# EAGLE design schemat1 (EAGLE 8.3.0)
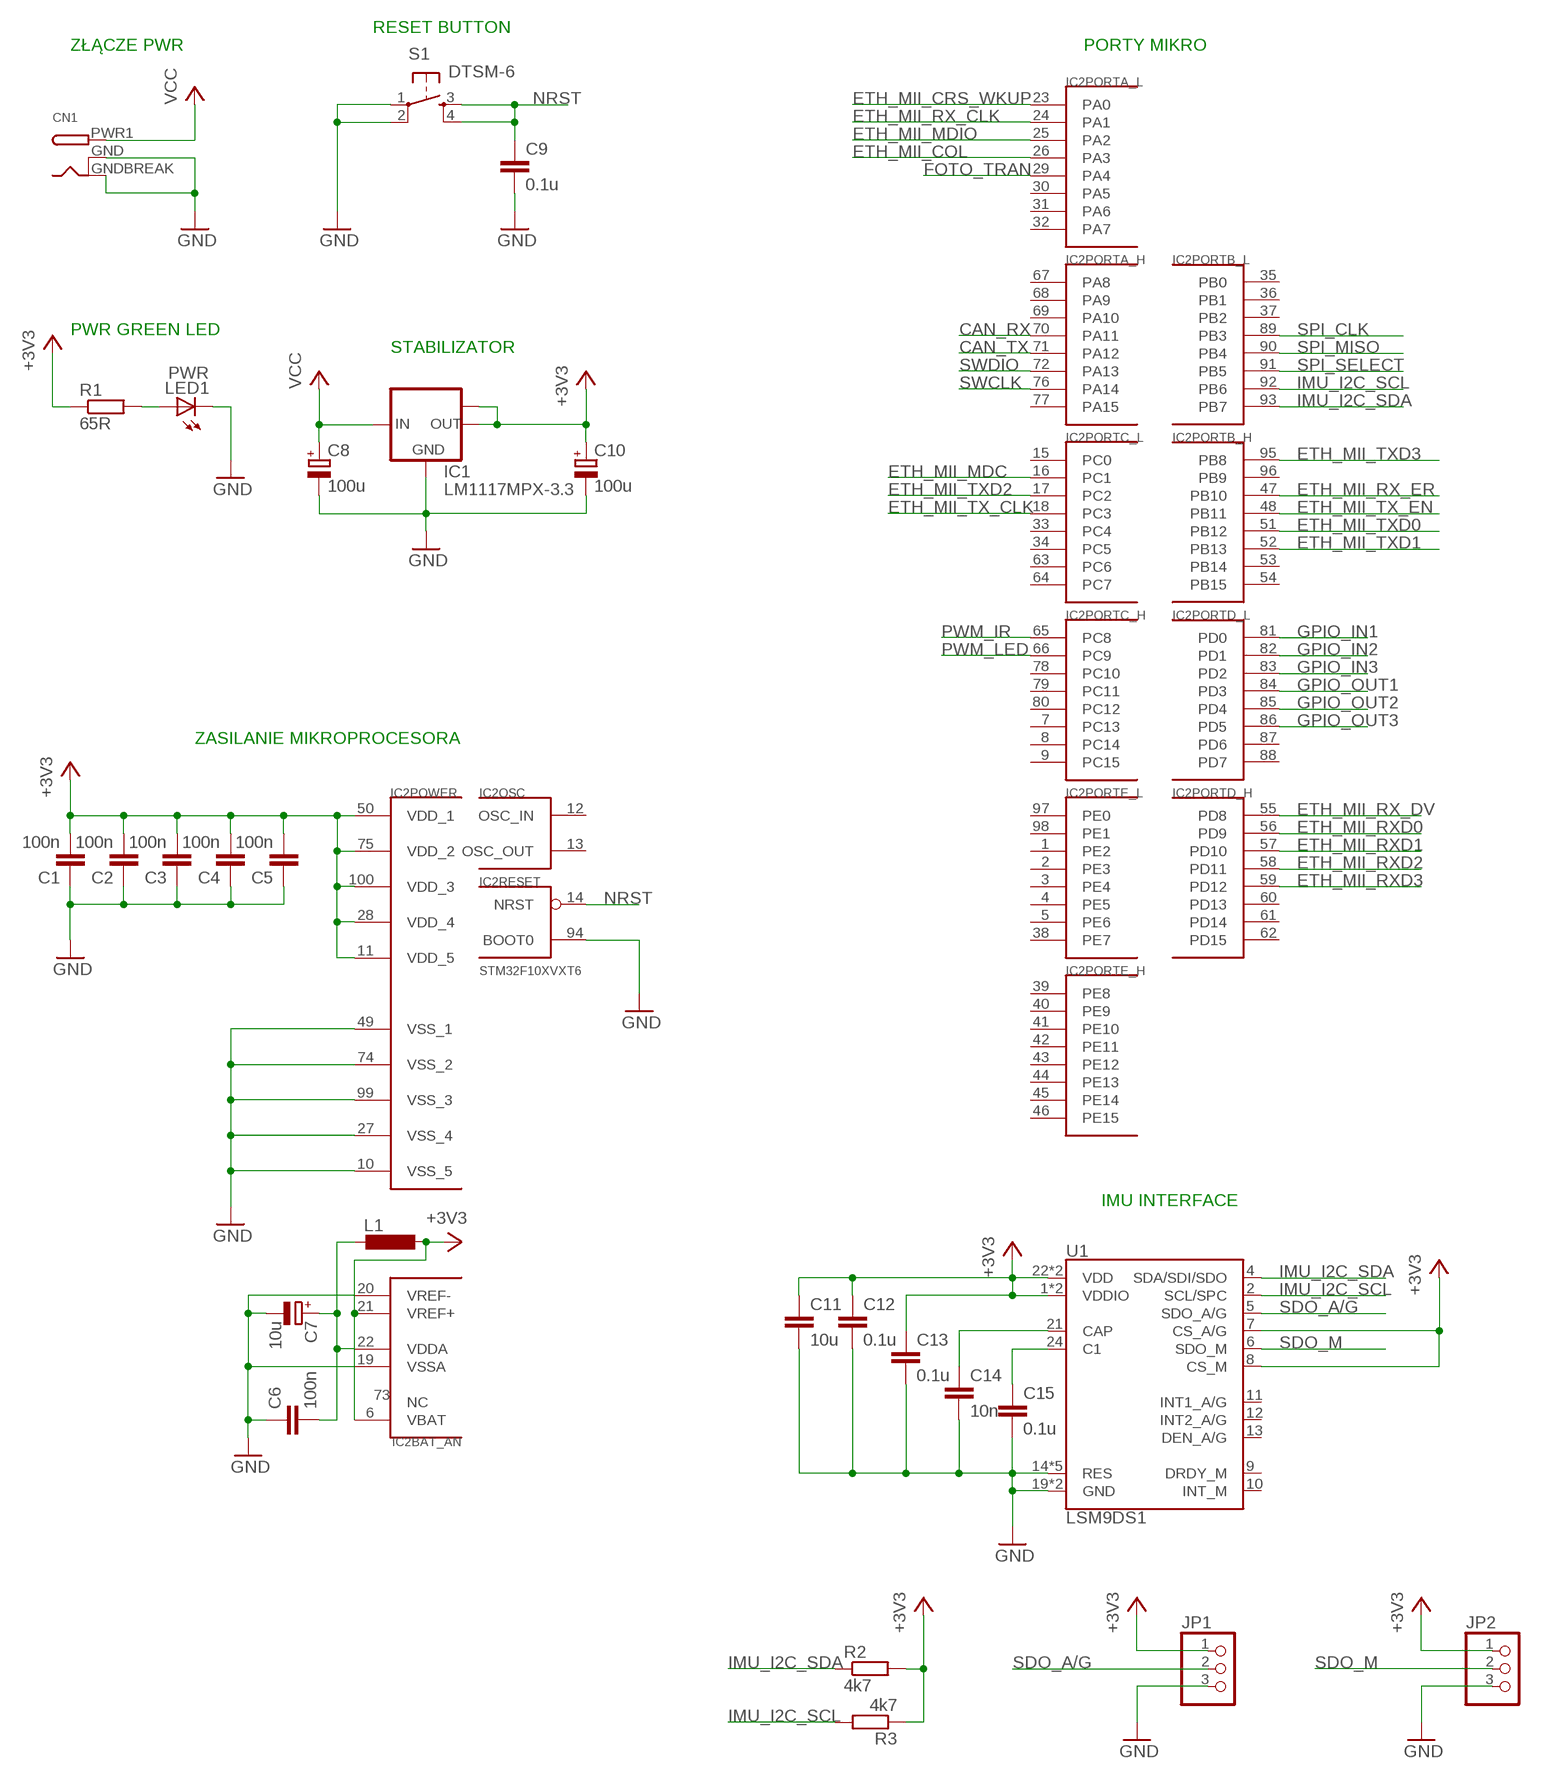
[diagram p0: schematic, sheet 1, part 1 of 2]
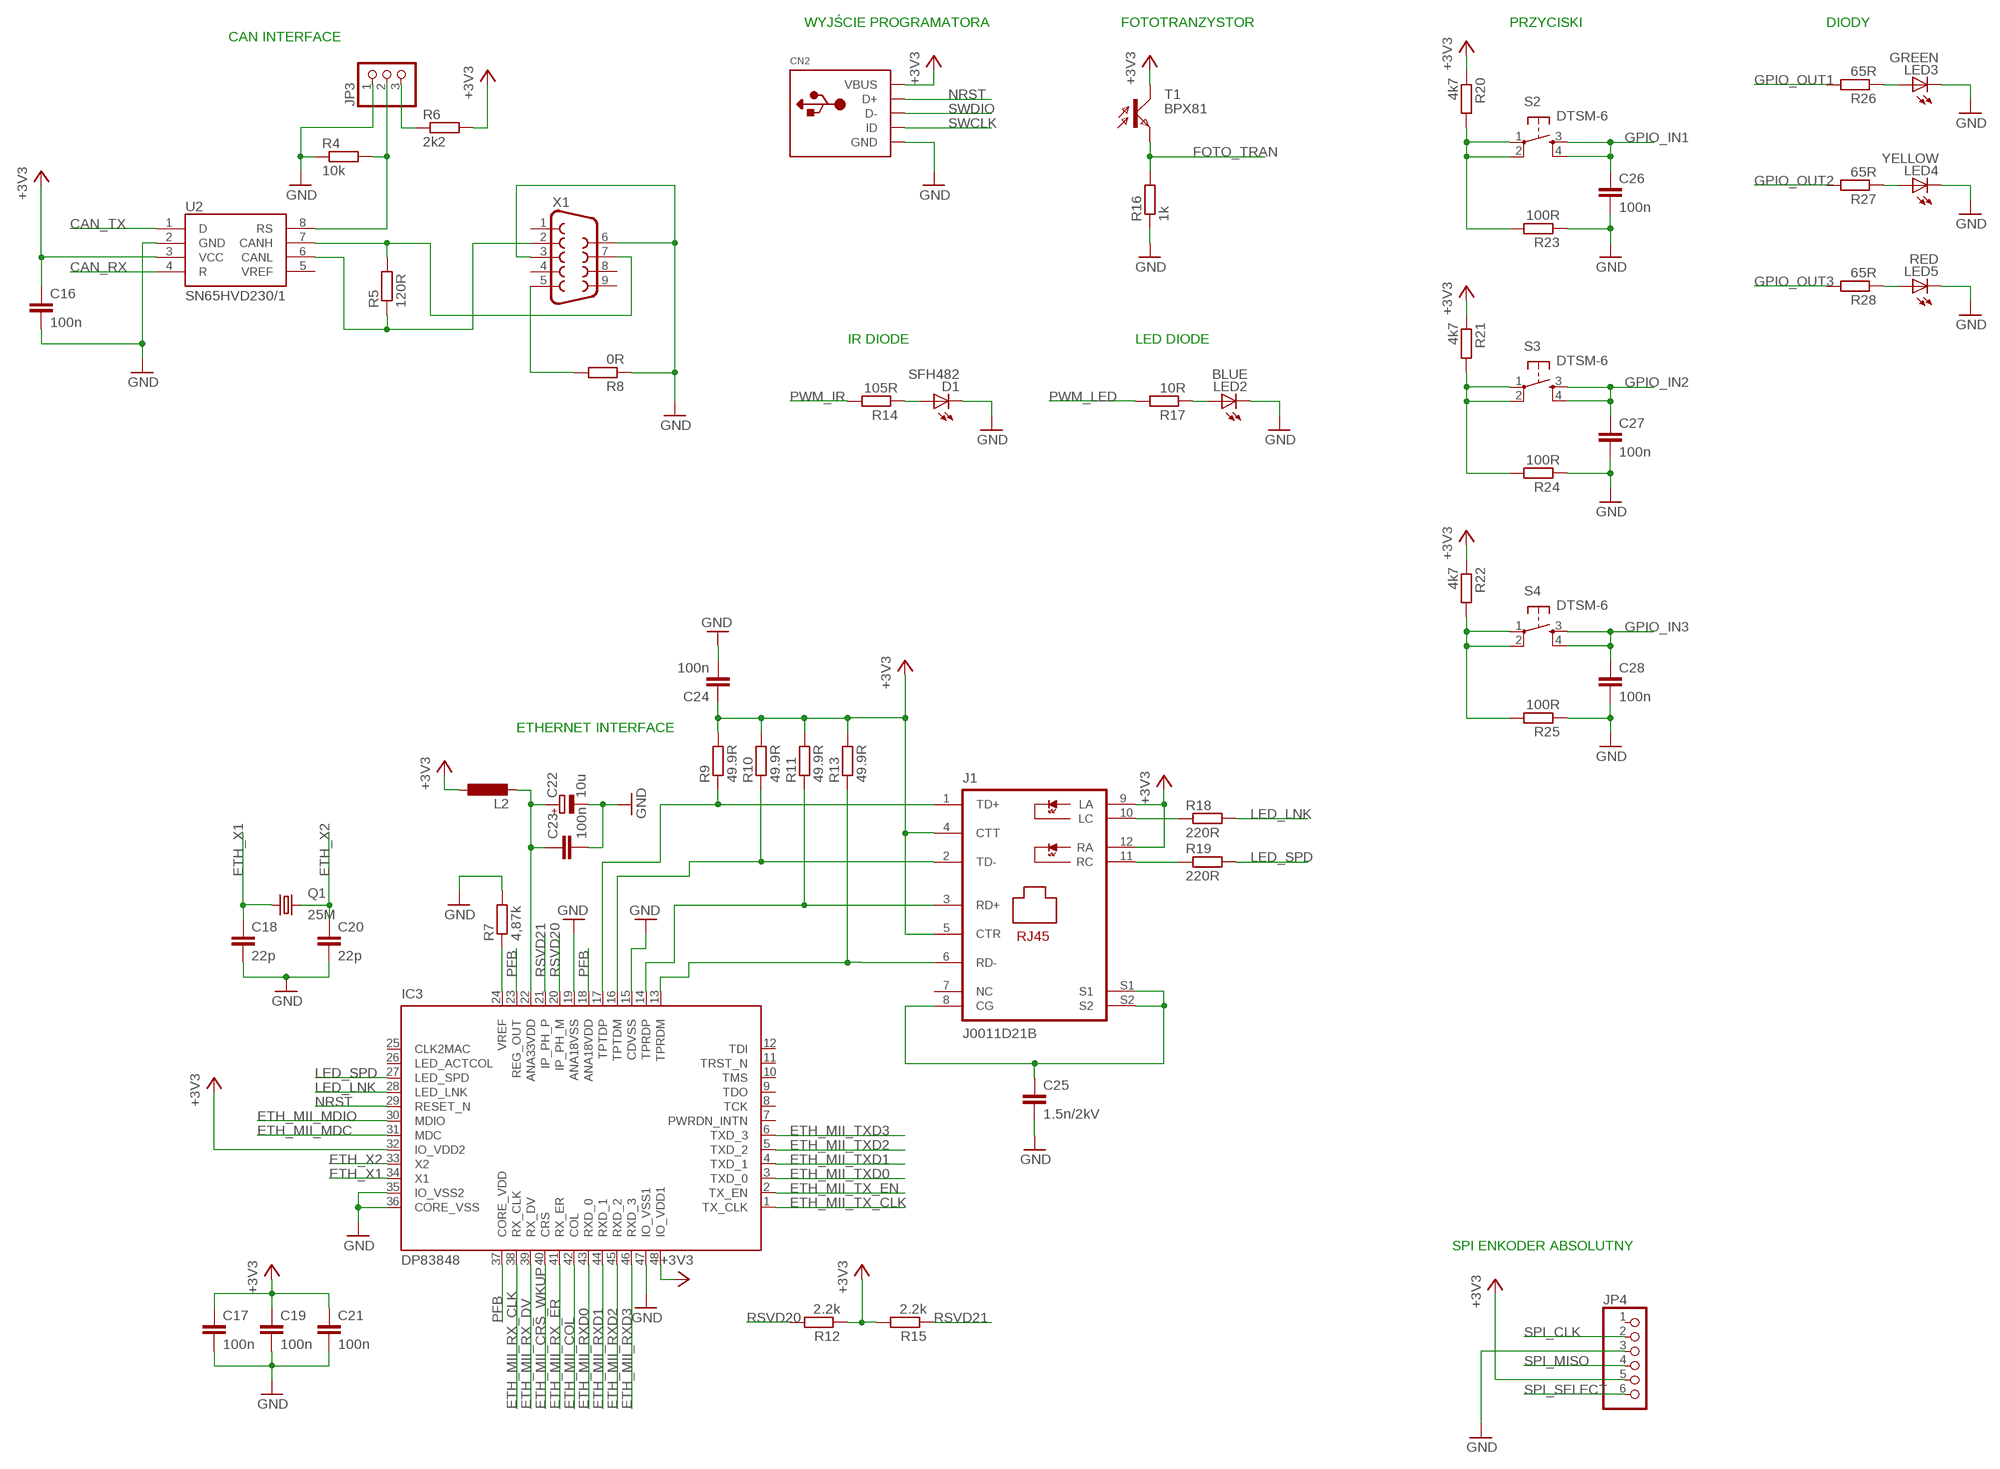
[diagram p1: schematic, sheet 1, part 2 of 2]

## Parts
C1  100n  C-EUC0805  [C0805]
C2  100n  C-EUC0805  [C0805]
C3  100n  C-EUC0805  [C0805]
C4  100n  C-EUC0805  [C0805]
C5  100n  C-EUC0805  [C0805]
C6  100n  C-EUC0805  [C0805]
C7  10u  CPOL-EUC  [PANASONIC_C]
C8  100u  CPOL-EUC  [PANASONIC_C]
C9  0.1u  C-EUC0805  [C0805]
C10  100u  CPOL-EUC  [PANASONIC_C]
C11  10u  C-EUC0805  [C0805]
C12  0.1u  C-EUC0805  [C0805]
C13  0.1u  C-EUC0805  [C0805]
C14  10n  C-EUC0805  [C0805]
C15  0.1u  C-EUC0805  [C0805]
C16  100n  C-EUC0805  [C0805]
C17  100n  C-EUC0805  [C0805]
C18  22p  C-EUC0805  [C0805]
C19  100n  C-EUC0805  [C0805]
C20  22p  C-EUC0805  [C0805]
C21  100n  C-EUC0805  [C0805]
C22  10u  CPOL-EUC  [PANASONIC_C]
C23  100n  C-EUC0805  [C0805]
C24  100n  C-EUC0805  [C0805]
C25  1.5n/2kV  C-EU050-030X075  [C050-030X075]
C26  100n  C-EUC0805  [C0805]
C27  100n  C-EUC0805  [C0805]
C28  100n  C-EUC0805  [C0805]
CN1  DCBARRELSMT  [DCJACK_2MM_SMT]
CN2  USBMINIB  [USB-MINIB]
D1  SFH482  [SFH482]
IC1  LM1117MPX-3.3  [SOT223]
IC2  STM32F10XVXT6  [TQFP100]
IC3  DP83848  [LQFP48]
J1  J0011D21B  [J0-A/B/F]
JP1  PINHD-1X3  [1X03]
JP2  PINHD-1X3  [1X03]
JP3  PINHD-1X3  [1X03]
JP4  PINHD-1X6/90  [1X06/90]
L1  L-EUL3230M  [L3230M]
L2  L-EUL3230M  [L3230M]
LED1  PWR  LEDCHIPLED_0805  [CHIPLED_0805]
LED2  BLUE  LED5MM  [LED5MM]
LED3  GREEN  LEDCHIPLED_0805  [CHIPLED_0805]
LED4  YELLOW  LEDCHIPLED_0805  [CHIPLED_0805]
LED5  RED  LEDCHIPLED_0805  [CHIPLED_0805]
Q1  25M  KX-7  [3.2X2.5_KX-7]
R1  65R  R-EU_R0805  [R0805]
R2  4k7  R-EU_M0805  [M0805]
R3  4k7  R-EU_M0805  [M0805]
R4  10k  R-EU_M0805  [M0805]
R5  120R  R-EU_M0805  [M0805]
R6  2k2  R-EU_M0805  [M0805]
R7  4,87k  R-EU_R0805  [R0805]
R8  0R  R-EU_R0805  [R0805]
R9  49.9R  R-EU_R0805  [R0805]
R10  49.9R  R-EU_R0805  [R0805]
R11  49.9R  R-EU_R0805  [R0805]
R12  2.2k  R-EU_R0805  [R0805]
R13  49.9R  R-EU_R0805  [R0805]
R14  105R  R-EU_M0805  [M0805]
R15  2.2k  R-EU_R0805  [R0805]
R16  1k  R-EU_R0805  [R0805]
R17  10R  R-EU_M0805  [M0805]
R18  220R  R-EU_R0805  [R0805]
R19  220R  R-EU_R0805  [R0805]
R20  4k7  R-EU_R0805  [R0805]
R21  4k7  R-EU_R0805  [R0805]
R22  4k7  R-EU_R0805  [R0805]
R23  100R  R-EU_R0805  [R0805]
R24  100R  R-EU_R0805  [R0805]
R25  100R  R-EU_R0805  [R0805]
R26  65R  R-EU_M0805  [M0805]
R27  65R  R-EU_M0805  [M0805]
R28  65R  R-EU_M0805  [M0805]
S1  DTSM-6  [DTSM-6]
S2  DTSM-6  [DTSM-6]
S3  DTSM-6  [DTSM-6]
S4  DTSM-6  [DTSM-6]
T1  BPX81  [BPX81]
U1  LSM9DS1  [LGA24-8X4]
U2  SN65HVD230/1  [SO8]
X1  F09HP  [F09HP]

## Nets
+3V3: C1.2 C2.2 C3.2 C4.2 C5.2 C10.+ C11.1 C12.1 C13.1 C16.1 C17.1 C19.1 C21.1 C24.1 CN2.VBUS IC1.2(OUT) IC1.TAB(OUT1) IC2.6(BAT_AN:VBAT) IC2.11(POWER:VDD_5) IC2.21(BAT_AN:VREF+) IC2.28(POWER:VDD_4) IC2.50(POWER:VDD_1) IC2.75(POWER:VDD_2) IC2.100(POWER:VDD_3) IC3.32(IO_VDD2) IC3.48(IO_VDD1) J1.4(CTT) J1.5(CTR) J1.9(LA) J1.12(RA) JP1.1 JP2.1 JP4.5 L1.1 L2.1 R1.1 R2.2 R3.1 R6.2 R9.2 R10.2 R11.2 R12.1 R13.2 R15.2 R20.1 R21.1 R22.1 T1.C U1.1(VDDIO) U1.3(VDDIO) U1.7(CS_A/G) U1.8(CS_M) U1.22(VDD) U1.23(VDD) U2.3(VCC)
CAN_RX: IC2.70(PORTA_H:PA11) U2.4(R)
CAN_TX: IC2.71(PORTA_H:PA12) U2.1(D)
ETH_MII_COL: IC2.26(PORTA_L:PA3) IC3.42(COL)
ETH_MII_CRS_WKUP: IC2.23(PORTA_L:PA0) IC3.40(CRS)
ETH_MII_MDC: IC2.16(PORTC_L:PC1) IC3.31(MDC)
ETH_MII_MDIO: IC2.25(PORTA_L:PA2) IC3.30(MDIO)
ETH_MII_RX_CLK: IC2.24(PORTA_L:PA1) IC3.38(RX_CLK)
ETH_MII_RX_DV: IC2.55(PORTD_H:PD8) IC3.39(RX_DV)
ETH_MII_RX_ER: IC2.47(PORTB_H:PB10) IC3.41(RX_ER)
ETH_MII_RXD0: IC2.56(PORTD_H:PD9) IC3.43(RXD_0)
ETH_MII_RXD1: IC2.57(PORTD_H:PD10) IC3.44(RXD_1)
ETH_MII_RXD2: IC2.58(PORTD_H:PD11) IC3.45(RXD_2)
ETH_MII_RXD3: IC2.59(PORTD_H:PD12) IC3.46(RXD_3)
ETH_MII_TX_CLK: IC2.18(PORTC_L:PC3) IC3.1(TX_CLK)
ETH_MII_TX_EN: IC2.48(PORTB_H:PB11) IC3.2(TX_EN)
ETH_MII_TXD0: IC2.51(PORTB_H:PB12) IC3.3(TXD_0)
ETH_MII_TXD1: IC2.52(PORTB_H:PB13) IC3.4(TXD_1)
ETH_MII_TXD2: IC2.17(PORTC_L:PC2) IC3.5(TXD_2)
ETH_MII_TXD3: IC2.95(PORTB_H:PB8) IC3.6(TXD_3)
ETH_X1: C18.1 IC3.34(X1) Q1.1
ETH_X2: C20.1 IC3.33(X2) Q1.3
FOTO_TRAN: IC2.29(PORTA_L:PA4) R16.2 T1.E
GND: C1.1 C2.1 C3.1 C4.1 C5.1 C6.1 C7.- C8.- C9.2 C10.- C11.2 C12.2 C13.2 C14.2 C15.2 C16.2 C17.2 C18.2 C19.2 C20.2 C21.2 C22.- C23.2 C24.2 C25.2 C26.2 C27.2 C28.2 CN1.GND(GNDBREAK) CN1.GNDBREAK(GND) CN2.GND D1.K(C) IC1.1(GND) IC2.10(POWER:VSS_5) IC2.19(BAT_AN:VSSA) IC2.20(BAT_AN:VREF-) IC2.27(POWER:VSS_4) IC2.49(POWER:VSS_1) IC2.74(POWER:VSS_2) IC2.94(RESET:BOOT0) IC2.99(POWER:VSS_3) IC3.15(CDVSS) IC3.19(ANA18VSS) IC3.35(IO_VSS2) IC3.36(CORE_VSS) IC3.47(IO_VSS1) JP1.3 JP2.3 JP3.1 JP4.3 LED1.C LED2.K(C) LED3.C LED4.C LED5.C R4.1 R7.2 R8.1 R16.1 R23.1 R24.1 R25.1 S1.1 S1.2 U1.14(RES) U1.15(RES) U1.16(RES) U1.17(RES) U1.18(RES) U1.19(GND) U1.20(GND) U2.2(GND) X1.3 X1.6
GPIO_IN1: C26.1 IC2.81(PORTD_L:PD0) S2.3 S2.4
GPIO_IN2: C27.1 IC2.82(PORTD_L:PD1) S3.3 S3.4
GPIO_IN3: C28.1 IC2.83(PORTD_L:PD2) S4.3 S4.4
GPIO_OUT1: IC2.84(PORTD_L:PD3) R26.2
GPIO_OUT2: IC2.85(PORTD_L:PD4) R27.2
GPIO_OUT3: IC2.86(PORTD_L:PD5) R28.2
IMU_I2C_SCL: IC2.92(PORTB_L:PB6) R3.2 U1.2(SCL/SPC)
IMU_I2C_SDA: IC2.93(PORTB_L:PB7) R2.1 U1.4(SDA/SDI/SDO)
LED_LNK: IC3.28(LED_LNK) R18.2
LED_SPD: IC3.27(LED_SPD) R19.2
N$1: IC3.13(TPRDM) J1.6(RD-) R13.1
N$2: R8.2 X1.5
N$3: R5.1 U2.6(CANL) X1.2
N$4: JP3.2 R4.2 U2.8(RS)
N$5: R5.2 U2.7(CANH) X1.7
N$6: JP3.3 R6.1
N$7: IC3.14(TPRDP) J1.3(RD+) R11.1
N$8: IC3.16(TPTDM) J1.2(TD-) R10.1
N$9: IC3.24(VREF) R7.1
N$10: IC3.17(TPTDP) J1.1(TD+) R9.1
N$11: C6.2 C7.+ IC2.22(BAT_AN:VDDA) L1.2
N$12: LED1.A R1.2
N$13: J1.10(LC) R18.1
N$14: J1.11(RC) R19.1
N$15: C15.1 U1.24(C1)
N$16: C14.1 U1.21(CAP)
N$17: D1.A R14.1
N$18: LED2.A R17.1
N$19: C25.1 J1.8(CG) J1.S1 J1.S2
N$20: R20.2 R23.2 S2.1 S2.2
N$21: R21.2 R24.2 S3.1 S3.2
N$22: R22.2 R25.2 S4.1 S4.2
N$23: LED3.A R26.1
N$24: C22.+ C23.1 IC3.22(ANA33VDD) L2.2
N$25: LED4.A R27.1
N$27: LED5.A R28.1
NRST: C9.1 CN2.D+ IC2.14(RESET:NRST) IC3.29(RESET_N) S1.3 S1.4
PFB: IC3.18(ANA18VDD) IC3.23(REG_OUT) IC3.37(CORE_VDD)
PWM_IR: IC2.65(PORTC_H:PC8) R14.2
PWM_LED: IC2.66(PORTC_H:PC9) R17.2
RSVD20: IC3.20(IP_PH_M) R12.2
RSVD21: IC3.21(IP_PH_P) R15.1
SDO_A/G: JP1.2 U1.5(SDO_A/G)
SDO_M: JP2.2 U1.6(SDO_M)
SPI_CLK: IC2.89(PORTB_L:PB3) JP4.2
SPI_MISO: IC2.90(PORTB_L:PB4) JP4.4
SPI_SELECT: IC2.91(PORTB_L:PB5) JP4.6
SWCLK: CN2.ID IC2.76(PORTA_H:PA14)
SWDIO: CN2.D- IC2.72(PORTA_H:PA13)
VCC: C8.+ CN1.PWR1(PWR) IC1.3(IN)
Unconnected: IC2.1(PORTE_L:PE2) IC2.2(PORTE_L:PE3) IC2.3(PORTE_L:PE4) IC2.4(PORTE_L:PE5) IC2.5(PORTE_L:PE6) IC2.7(PORTC_H:PC13) IC2.8(PORTC_H:PC14) IC2.9(PORTC_H:PC15) IC2.12(OSC:OSC_IN) IC2.13(OSC:OSC_OUT) IC2.15(PORTC_L:PC0) IC2.30(PORTA_L:PA5) IC2.31(PORTA_L:PA6) IC2.32(PORTA_L:PA7) IC2.33(PORTC_L:PC4) IC2.34(PORTC_L:PC5) IC2.35(PORTB_L:PB0) IC2.36(PORTB_L:PB1) IC2.37(PORTB_L:PB2) IC2.38(PORTE_L:PE7) IC2.39(PORTE_H:PE8) IC2.40(PORTE_H:PE9) IC2.41(PORTE_H:PE10) IC2.42(PORTE_H:PE11) IC2.43(PORTE_H:PE12) IC2.44(PORTE_H:PE13) IC2.45(PORTE_H:PE14) IC2.46(PORTE_H:PE15) IC2.53(PORTB_H:PB14) IC2.54(PORTB_H:PB15) IC2.60(PORTD_H:PD13) IC2.61(PORTD_H:PD14) IC2.62(PORTD_H:PD15) IC2.63(PORTC_L:PC6) IC2.64(PORTC_L:PC7) IC2.67(PORTA_H:PA8) IC2.68(PORTA_H:PA9) IC2.69(PORTA_H:PA10) IC2.73(BAT_AN:NC) IC2.77(PORTA_H:PA15) IC2.78(PORTC_H:PC10) IC2.79(PORTC_H:PC11) IC2.80(PORTC_H:PC12) IC2.87(PORTD_L:PD6) IC2.88(PORTD_L:PD7) IC2.96(PORTB_H:PB9) IC2.97(PORTE_L:PE0) IC2.98(PORTE_L:PE1) IC3.7(PWRDN_INTN) IC3.8(TCK) IC3.9(TDO) IC3.10(TMS) IC3.11(TRST_N) IC3.12(TDI) IC3.25(CLK2MAC) IC3.26(LED_ACTCOL) J1.7(NC) JP4.1 U1.9(DRDY_M) U1.10(INT_M) U1.11(INT1_A/G) U1.12(INT2_A/G) U1.13(DEN_A/G) U2.5(VREF) X1.1 X1.4 X1.8 X1.9

## Notes on the sheet
- RESET BUTTON | WYJŚCIE PROGRAMATORA | FOTOTRANZYSTOR | PRZYCISKI | DIODY
- ZŁĄCZE PWR | PORTY MIKRO | CAN INTERFACE
- PWR GREEN LED
- STABILIZATOR
- IR DIODE | LED DIODE
- ZASILANIE MIKROPROCESORA
- ETHERNET INTERFACE
- IMU INTERFACE
- SPI ENKODER ABSOLUTNY

## Library data of the parts
C1-C6 C9 C11-C16 C23-C28 = rcl:C-EU: CAPACITOR, European symbol
C7 C8 C10 C22 = rcl:CPOL-EU: POLARIZED CAPACITOR, European symbol
C17-C21 = resistor:C-EU: CAPACITOR, European symbol
CN1 = adafruit:DCBARREL: 2.0mm DC Barrel Jack DCJACK_2MM_PTH - Through Hole Jack (4UConnector: 05537)
CN2 = adafruit:USB: USB Connectors USBMINIB - Surface Mount Female Mini-B USB Connector 4UConnector: 06564 By microbuilder.eu Thru-hole RA Female Mini-B USB Connector 4UConnector: 18732 By ladyada.net
D1 = led:SFH482: IR LED infrared emitting diode, Infineon
IC1 = lm1117:LM1117MPX-*
IC2 = stm32:STM32F10XVXT6: STM32F101/103 100 pin LQFP
IC3 = national-semiconductor:DP83848: PHYTER® - Extended Temperature Single Port 10/100 Mb/s Ethernet Physical Layer Transceiver Auto generated by make-symbol-device-package-bsdl.ulp Rev. 34 Source: dp83848yb.bsdl http://www.national.com/ds/DP/DP83848VYB.pdf; MPN: DP83848VYB; OC_FARNELL: 1286817; OC_NEWARK: 11N4484
J1 = pulse-eng:J0011D21B: RJ45 PulseJack w/LEDs
JP1 JP2 = pinhead:PINHD-1X3: PIN HEADER
JP3 = adafruit:PINHD-1X3: PIN HEADER
JP4 = pinhead:PINHD-1X6: PIN HEADER
L1 L2 = rcl:L-EU: INDUCTOR, European symbol
LED1-LED5 = adafruit:LED: LED OSRAM: - CHIPLED LG R971, LG N971, LY N971, LG Q971, LY Q971, LO R971, LY R971 LH N974, LH R974 LS Q976, LO Q976, LY Q976 LO Q996 - Hyper CHIPLED LW Q18S LB Q993, LB Q99A, LB R99A - SideLED LS A670, LO A670, LY A670, LG A670, LP A670 LB A673, LV A673, LT A673, LW A673 LH A674 LY A675 LS A676, LA A676, LO A676, LY A676, LW A676 LS A679, LY A679, LG A679 - Hyper Micro SIDELED® LS Y876, LA Y876, LO Y876, LY Y876 LT Y87S - SmartLED LW L88C, LW L88S LB L89C, LB L89S, LG L890 LS L89K, LO L89K, LY L89K LS L896, LA L896, LO L896, LY L896 - TOPLED LS T670, LO T670, LY T670, LG T670, LP T670 LSG T670, LSP T670, LSY T670, LOP T670, LYG T670 LG T671, LOG T671, LSG T671 LB T673, LV T673, LT T673, LW T673 LH T674 LS T676, LA T676, LO T676, LY T676, LB T676, LH T676, LSB T676, LW T676 LB T67C, LV T67C, LT T67C, LS T67K, LO T67K, LY T67K, LW E67C LS E67B, LA E67B, LO E67B, LY E67B, LB E67C, LV E67C, LT E67C LW T67C LS T679, LY T679, LG T679 LS T770, LO T770, LY T770, LG T770, LP T770 LB T773, LV T773, LT T773, LW T773 LH T774 LS E675, LA E675, LY E675, LS T675 LS T776, LA T776, LO T776, LY T776, LB T776 LHGB T686 LT T68C, LB T68C - Hyper Mini TOPLED® LB M676 - Mini TOPLED Santana® LG M470 LS M47K, LO M47K, LY M47K Source: http://www.osram.convergy.de/
Q1 = crystal-geyer_V1_0:KX: Quartz Crystals (MHz) SMD: KX - Serie Model Size l/w/h [mm] Frequency Range Frequency Stability Temp. Range [°C] Load Capacitance AECQ 200 availabel Datasheet KX-4 KX-5 KX-6 KX-7 KX-9A KX-9B KX-12A KX-12B KX-13 KX-20 KX-K KX-KS 1.6/1.2/0.3 2.0/1.6/0.45 2.5/2.0/0.55 3.2/2.5/0.8 5.0/3.2/1.0 5.0/3.2/1.1 6.0/3.5/1.1 6.0/3.5/1.0 7.0/5.0 /1.3 11.6/5.5/1.6 12.3/4.5/4.2 12.3/4.5/3.2 24.0 ~ 80.0 MHz 16.0 ~ 80.0 MHz 12.0 ~ 80.0 MHz 8.0 ~ 60.0 MHz 7,68 ~ 300,0 MHz 8,0 ~ 50,0 MHz 8,0 ~ 150,0 MHz 8,0 ~ 50,0 MHz 6,0 ~ 160,0 MHz 3,579 ~ 25,0 MHz 3,579 ~ 70,0 MHz 3,579 ~ 70,0 MHz ±10 … ±50ppm ±10 … ±50ppm ±10 … ±50ppm ±10 … ±50ppm ±10 … ±50ppm ±10 … ±50ppm ±10 … ±50ppm ±10 … ±50ppm ±10 … ±50ppm ±50ppm ±10 … ±50ppm ±10 … ±50ppm (*) -40°C …+85°C (*) -40°C …+125°C (*) -40°C …+125°C (*) -40°C …+125°C (*) -40°C …+105°C (*) -40°C …+105°C (*) -40°C …+125°C (*) -40°C …+105°C (*) -40°C …+105°C (*) -40°C …+105°C (*) -40°C …+85°C (*) -40°C …+85°C 8, 8…16 8, 8…16 10, 8…16 12, 7…20 16, 10…20 16, 10…20 16, 10…20 16, 12…20 16, 12…20 16, 12…20 16, 12…30 16, 12…30 - yes yes yes - - - - - - - - KX-4.pdf <http://www.geyer-electronic.de/uploads/tx_userartikelfrequenz/GEYER-KX-4.pdf> KX-5.pdf <http://www.geyer-electronic.de/uploads/tx_userartikelfrequenz/GEYER-KX-5.pdf> KX-6.pdf <http://www.geyer-electronic.de/uploads/tx_userartikelfrequenz/GEYER-KX-6.pdf> KX-7.pdf <http://www.geyer-electronic.de/uploads/tx_userartikelfrequenz/GEYER-KX-7.pdf> KX-9A.pdf <http://www.geyer-electronic.de/uploads/tx_userartikelfrequenz/GEYER-KX-9A.pdf> KX-9B.pdf <http://www.geyer-electronic.de/uploads/tx_userartikelfrequenz/GEYER-KX-9B.pdf> KX-12A.pdf <http://www.geyer-electronic.de/uploads/tx_userartikelfrequenz/GEYER-KX-12A.pdf> KX-12B.pdf <http://www.geyer-electronic.de/uploads/tx_userartikelfrequenz/GEYER-KX-12B.pdf> KX-13.pdf <http://www.geyer-electronic.de/uploads/tx_userartikelfrequenz/GEYER-KX-13.pdf> KX-20.pdf <http://www.geyer-electronic.de/uploads/tx_userartikelfrequenz/GEYER-KX-20.pdf> KX-K.pdf <http://www.geyer-electronic.de/uploads/tx_userartikelfrequenz/GEYER-KX-K.pdf> KX-KS.pdf <http://www.geyer-electronic.de/uploads/tx_userartikelfrequenz/GEYER-KX-KS.pdf> <http://www.geyer-electronic.de/fileadmin/template/img/logo-geyer-electronic.png> Details see: http://www.geyer-electronic.de/Frequenz-Produkte.9.0.html Created 2016-06-07, Hans Locher 2016 (C) Geyer Quartz Technology KX4,KX5,KX6,KX7,KX9A,KX9B,KX12A,KX12B,KX13,KX20,KXK,KXKS;1612;2016;2520;3225;5032;6035;7050;11655;12345;1,6x1,2;2,0x1,6;2,5x2,0;3,2x2,5;5,0x3,2;6,0x3,5;7,0x5,0;11,6x5,5;12,3x4,5;12,3x4,5;1.6x1.2;2.0x1.6;2.5x2.0;3.2x2.5;5.0x3.2;6.0x3.5;7.0x5.0;11.6x5.5;12.3x4.5;12.3x4.5;
R1 R4-R7 R9-R11 R13 R18 R19 = resistor:R-EU_: RESISTOR, European symbol
R2 R3 R8 R12 R14-R17 R20-R28 = rcl:R-EU_: RESISTOR, European symbol
S1-S4 = switch-tact:DTSM-6
T1 = opto-trans-siemens:BPX81: PHOTO TRANSISTOR; OC_FARNELL: unknown; OC_NEWARK: unknown
U1 = LSM9DS1_temp:LSM9DS1: LSM9DS1 3D accelerometer, gyroscope & magnetometer The LSM9DS1 is a system-in-package featuring a 3D digital linear acceleration sensor, a 3D digital angular rate sensor, and a 3D digital magnetic sensor. The LSM9DS1 has a linear acceleration full scale of ±2g/±4g/±8/±16 g, a magnetic field full scale of ±4/±8/±12/±16 gauss and an angular rate of ±245/±500/±2000 dps. The LSM9DS1 includes an I2 C serial bus interface supporting standard and fast mode (100 kHz and 400 kHz) and an SPI serial standard interface. Magnetic, accelerometer and gyroscope sensing can be enabled or set in power-down mode separately for smart power management. The LSM9DS1 is available in a plastic land grid array package (LGA) and it is guaranteed to operate over an extended temperature range from -40 °C to +85 °C.; PROD_ID: IC-12536
U2 = texas_instruments:SN65HVD230/1
X1 = con-subd:F09: SUB-D; OC_FARNELL: unknown; OC_NEWARK: unknown

## Board
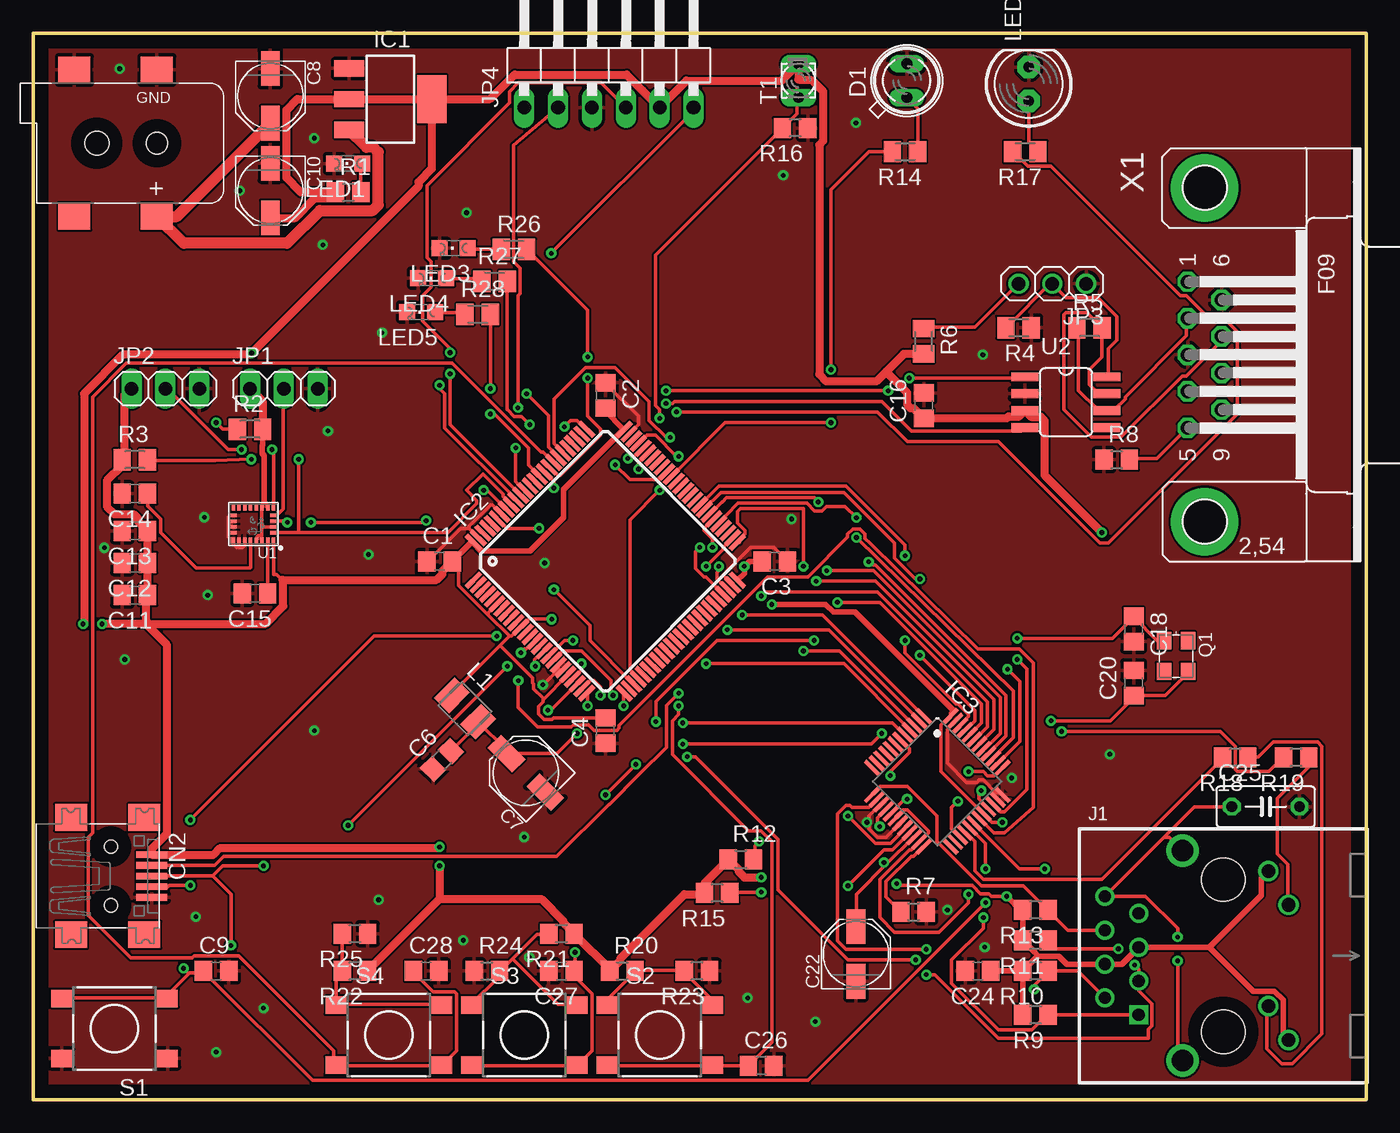
[diagram p2: board, top side]
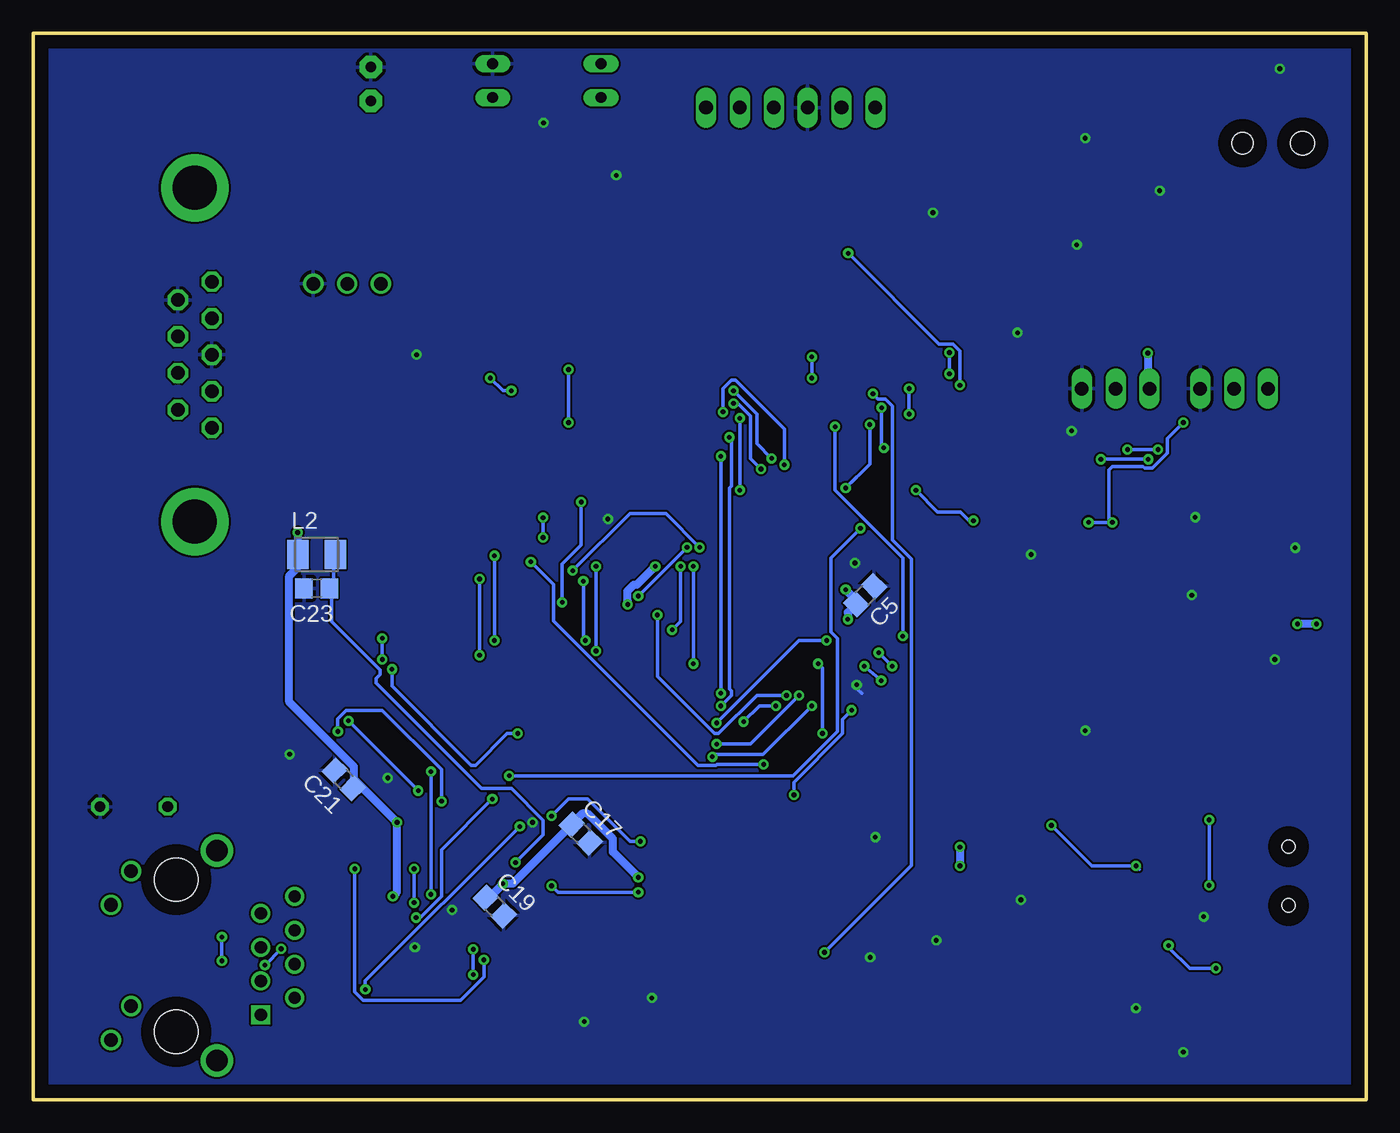
[diagram p3: board, bottom side, seen from below]

Size 100 x 80 mm. Coordinates in mm from the lower left corner, seen from the top.
Outline: 0,0 100,0 100,80 0,80 0,0
Copper layers (1*16): Top 0.035mm / dielectric 1.5mm / Bottom 0.035mm
Design rules "default *": minimum track width 10mil, minimum drill 0.35mm, track to track 6mil, track to pad 6mil, pad to pad 6mil, via to via 6mil, smd to smd 6mil, copper to edge 40mil, drill to drill 6mil, minimum pad ring 10mil, minimum via ring 8mil, stop-mask expansion 4mil, vias tented up to drill 0mil, thermal gap 10mil

### Footprints (pad centres in the part's own frame; a part is rotated, then mirrored left to right if it is on the bottom)
C0805 = smd 1.3 x 1.5: 1 -0.95,0; 2 0.95,0
PANASONIC_C = smd 2.6 x 1.4: + 2.05,0; - -2.05,0
C050-030X075 = drill 0.813 octagon: 1 -2.54,0; 2 2.54,0
DCJACK_2MM_SMT = smd 2.4 x 2: GND 0,-5.5; GNDBREAK 6.2,-5.5; PWR1 0,5.5; PWR2 6.2,5.5 | hole 1.6: 0,0 | hole 1.8: 4.5,0
USB-MINIB = smd 0.5 x 2.308: D+ 0,4.064; D- -0.8,4.064; GND 1.6,4.064; ID 0.8,4.064; VBUS -1.6,4.064 | smd 2 x 2.4: GND1 -4.4,-2; GND2 -4.4,3.5; GND3 4.4,3.5; GND4 4.4,-2 | hole 1: -2.2,1; 2.2,1
SFH482 = drill 0.813 long: A -1.27,0; K 1.27,0
SOT223 = smd 1.219 x 2.235: 1 -2.311,-3.099; 2 0,-3.099; 3 2.311,-3.099 | smd 3.6 x 2.2: TAB 0,3.099
TQFP100 = smd 1.5 x 0.35: 1 -8,6; 2 -8,5.5; 3 -8,5; 4 -8,4.5; 5 -8,4; 6 -8,3.5; 7 -8,3; 8 -8,2.5; 9 -8,2; 10 -8,1.5; 11 -8,1; 12 -8,0.5; 13 -8,0; 14 -8,-0.5; 15 -8,-1; 16 -8,-1.5; 17 -8,-2; 18 -8,-2.5; 19 -8,-3; 20 -8,-3.5; 21 -8,-4; 22 -8,-4.5; 23 -8,-5; 24 -8,-5.5; 25 -8,-6; 51 8,-6; 52 8,-5.5; 53 8,-5; 54 8,-4.5; 55 8,-4; 56 8,-3.5; 57 8,-3; 58 8,-2.5; 59 8,-2; 60 8,-1.5; 61 8,-1; 62 8,-0.5; 63 8,0; 64 8,0.5; 65 8,1; 66 8,1.5; 67 8,2; 68 8,2.5; 69 8,3; 70 8,3.5; 71 8,4; 72 8,4.5; 73 8,5; 74 8,5.5; 75 8,6 | smd 0.35 x 1.5: 26 -6,-8; 27 -5.5,-8; 28 -5,-8; 29 -4.5,-8; 30 -4,-8; 31 -3.5,-8; 32 -3,-8; 33 -2.5,-8; 34 -2,-8; 35 -1.5,-8; 36 -1,-8; 37 -0.5,-8; 38 0,-8; 39 0.5,-8; 40 1,-8; 41 1.5,-8; 42 2,-8; 43 2.5,-8; 44 3,-8; 45 3.5,-8; 46 4,-8; 47 4.5,-8; 48 5,-8; 49 5.5,-8; 50 6,-8; 76 6,8; 77 5.5,8; 78 5,8; 79 4.5,8; 80 4,8; 81 3.5,8; 82 3,8; 83 2.5,8; 84 2,8; 85 1.5,8; 86 1,8; 87 0.5,8; 88 0,8; 89 -0.5,8; 90 -1,8; 91 -1.5,8; 92 -2,8; 93 -2.5,8; 94 -3,8; 95 -3.5,8; 96 -4,8; 97 -4.5,8; 98 -5,8; 99 -5.5,8; 100 -6,8
LQFP48 = smd 1.5 x 0.3: 1 -4.15,2.75; 2 -4.15,2.25; 3 -4.15,1.75; 4 -4.15,1.25; 5 -4.15,0.75; 6 -4.15,0.25; 7 -4.15,-0.25; 8 -4.15,-0.75; 9 -4.15,-1.25; 10 -4.15,-1.75; 11 -4.15,-2.25; 12 -4.15,-2.75; 25 4.15,-2.75; 26 4.15,-2.25; 27 4.15,-1.75; 28 4.15,-1.25; 29 4.15,-0.75; 30 4.15,-0.25; 31 4.15,0.25; 32 4.15,0.75; 33 4.15,1.25; 34 4.15,1.75; 35 4.15,2.25; 36 4.15,2.75 | smd 0.3 x 1.5: 13 -2.75,-4.15; 14 -2.25,-4.15; 15 -1.75,-4.15; 16 -1.25,-4.15; 17 -0.75,-4.15; 18 -0.25,-4.15; 19 0.25,-4.15; 20 0.75,-4.15; 21 1.25,-4.15; 22 1.75,-4.15; 23 2.25,-4.15; 24 2.75,-4.15; 37 2.75,4.15; 38 2.25,4.15; 39 1.75,4.15; 40 1.25,4.15; 41 0.75,4.15; 42 0.25,4.15; 43 -0.25,4.15; 44 -0.75,4.15; 45 -1.25,4.15; 46 -1.75,4.15; 47 -2.25,4.15; 48 -2.75,4.15
J0-A/B/F = drill 0.914 square: 1 4.445,-6.35 | drill 0.914: 2 3.175,-8.89; 3 1.905,-6.35; 4 0.635,-8.89; 5 -0.635,-6.35; 6 -1.905,-8.89; 7 -3.175,-6.35; 8 -4.445,-8.89 | drill 1.016: 9 6.325,4.902; 10 3.785,3.378; 11 -3.81,4.902; 12 -6.35,3.378 | drill 1.626: S1 -7.874,-3.048; S2 7.874,-3.048 | hole 3.251: -5.715,0; 5.715,0
1X03 = drill 1.016 long: 1 -2.54,0; 2 0,0; 3 2.54,0
1X03' = drill 1.016: 1 -2.54,0; 2 0,0; 3 2.54,0
1X06/90 = drill 1.016 long: 1 -6.35,-3.81; 2 -3.81,-3.81; 3 -1.27,-3.81; 4 1.27,-3.81; 5 3.81,-3.81; 6 6.35,-3.81
L3230M = smd 1.6 x 2.2: 1 -1.4,0; 2 1.4,0
CHIPLED_0805 = smd 1.2 x 1.2: A 0,-1.05; C 0,1.05
LED5MM = drill 0.813 pad 1.676 octagon: A -1.27,0; K 1.27,0
3.2X2.5_KX-7 = smd 1.3 x 1.1: 1 -1.15,-0.9; 2 1.15,-0.9; 3 1.15,0.9; 4 -1.15,0.9
R0805 = smd 1.3 x 1.5: 1 -0.95,0; 2 0.95,0
M0805 = smd 1.3 x 1.6: 1 -0.95,0; 2 0.95,0
DTSM-6 = smd 1.55 x 1.3: 1 -3.975,2.25; 2 3.975,2.25; 3 -3.975,-2.25; 4 3.975,-2.25
BPX81 = drill 0.813 long: C 1.27,0; E -1.27,0
LGA24-8X4 = smd 0.27 x 0.45: 1 -1.505,1.225; 6 -1.505,-1.225; 7 -1.075,-1.225; 8 -0.645,-1.225; 9 -0.215,-1.225; 10 0.215,-1.225; 11 0.645,-1.225; 12 1.075,-1.225; 13 1.505,-1.225; 18 1.505,1.225; 19 1.075,1.225; 20 0.645,1.225; 21 0.215,1.225; 22 -0.215,1.225; 23 -0.645,1.225; 24 -1.075,1.225 | smd 0.45 x 0.27: 2 -1.475,0.645; 3 -1.475,0.215; 4 -1.475,-0.215; 5 -1.475,-0.645; 14 1.475,-0.645; 15 1.475,-0.215; 16 1.475,0.215; 17 1.475,0.645
SO8 = smd 0.66 x 2.032: 1 -1.905,-3.073; 2 -0.635,-3.073; 3 0.635,-3.073; 4 1.905,-3.073; 5 1.905,3.073; 6 0.635,3.073; 7 -0.635,3.073; 8 -1.905,3.073
F09HP = drill 1.016 octagon: 1 -5.486,-1.27; 2 -2.743,-1.27; 3 0,-1.27; 4 2.743,-1.27; 5 5.486,-1.27; 6 -4.115,1.27; 7 -1.372,1.27; 8 1.372,1.27; 9 4.115,1.27 | drill 3.302 pad 5.08: G1 -12.522,0; G2 12.522,0

### Placement (x,y rotation side)
C1  30.48,40.39 0 top
C2  42.93,52.83 270 top
C3  55.63,40.39 180 top
C4  42.93,27.69 90 top
C5  37.59,37.85 225 bottom
C6  30.66,25.47 45 top
C7  36.96,24.51 135 top
C8  17.78,75.31 270 top
C9  13.72,9.65 0 top
C10  17.78,68.2 270 top
C11  7.62,37.85 180 top
C12  7.62,40.26 180 top
C13  7.62,42.67 180 top
C14  7.62,45.47 180 top
C15  16.64,37.97 180 top
C16  66.8,52.07 90 top
C17  58.93,19.96 315 bottom
C18  82.55,35.31 270 top
C19  65.38,14.48 315 bottom
C20  82.55,31.24 90 top
C21  76.71,24.02 135 bottom
C22  61.72,10.92 90 top
C23  78.74,38.35 180 bottom
C24  70.87,9.65 180 top
C25  92.46,21.97 0 top
C26  54.61,2.54 0 top
C27  39.62,9.65 180 top
C28  29.46,9.65 0 top
CN1  9.27,71.75 180 top
CN2  4.83,16.76 270 top
D1  65.53,76.45 90 top
IC1  26.8,75.06 270 top
IC2  42.93,40.39 45 top
IC3  67.82,23.88 315 top
J1  89.28,10.79 270 top
JP1  18.8,53.34 0 top
JP2  9.91,53.34 0 top
JP3  [1X03']  76.45,61.21 180 top
JP4  43.18,78.23 0 top
L1  32.38,29.34 315 top
L2  78.74,40.89 0 bottom
LED1  23.62,70.23 90 top
LED2  74.68,76.2 90 top
LED3  31.54,63.88 90 top
LED4  29.94,61.63 90 top
LED5  29.1,59.09 90 top
Q1  85.72,33.27 270 top
R1  23.62,68.07 0 top
R2  16.26,50.29 0 top
R3  7.62,48.01 0 top
R4  73.91,57.91 180 top
R5  79.25,57.91 0 top
R6  66.8,56.9 270 top
R7  66.04,14.1 0 top
R8  81.28,48.01 0 top
R9  75.18,6.35 180 top
R10  75.18,9.65 180 top
R11  75.18,11.94 180 top
R12  53.09,18.03 0 top
R13  75.18,14.22 180 top
R14  65.41,71.12 180 top
R15  51.31,15.49 180 top
R16  57.15,72.9 180 top
R17  74.42,71.12 180 top
R18  90.17,25.65 180 top
R19  94.74,25.65 180 top
R20  44.2,9.65 0 top
R21  39.62,12.45 180 top
R22  24.13,9.65 180 top
R23  49.78,9.65 180 top
R24  34.04,9.65 0 top
R25  24.13,12.45 180 top
R26  36.06,63.78 0 top
R27  34.61,61.38 0 top
R28  33.34,58.91 0 top
S1  6.1,5.33 180 top
S2  46.99,4.83 0 top
S3  36.83,4.83 0 top
S4  26.67,4.83 0 top
T1  57.4,76.45 90 top
U1  16.51,43.18 180 top
U2  77.47,52.32 270 top
X1  87.88,55.88 270 top

### Tracks (layer width: path | path; a pad name or v marks a point on that pad's centre or on a via)
+3V3  (via drill 0.35)
  Top 0.254: 71.28,21.43 68.1,24.61 68.1,28.1 68.74,28.73 IC3.48 68.81,29 69.02,29.2 | v72.71,20.8 71.91,20.8 71.28,21.43 | 71.28,21.43 IC3.32 | R11.2 74.3,12.06 | 74.3,14.13 R13.2 74.14,14.29 | 71.91,9.68 C24.1 | 74.14,9.68 R10.2 74.3,9.53 | 74.3,6.35 74.26,6.35 R9.2 | C4.2 42.86,28.73 | 40.01,31.75 IC2.21 | 31.75,40.48 31.43,40.48 C1.2 31.91,40.48 31.91,38.58 34.13,36.35 | 33.02,41.75 IC2.100 | 35.72,34.77 35.88,34.77 36.51,35.4 IC2.11 | 34.13,36.35 35.72,34.77 | 34.13,36.35 34.13,36.51 34.77,37.15 IC2.6 | 36.67,35.56 IC2.11 | v39.05,38.26 41.75,35.56 41.75,34.45 44.93,31.27 IC2.28 | 33.5,41.12 33.02,41.59 IC2.100 | 50.48,15.56 R15.2 50.32,15.4 | 52.07,17.94 R12.1 52.23,17.94 | R22.1 25.08,9.68 | 40.48,12.54 R21.1 40.48,12.38 | 43.18,9.68 R20.1 43.34,9.68 | 17.14,42.97 17.14,44.29 U1.8 17.22,44.47 17.22,44.74 17.31,44.83 17.31,44.91 17.38,44.83 17.43,44.83 17.52,44.74 17.52,44.47 U1.7 | 17.14,42.97 17.14,42.07 U1.23 17.09,42.02 17.09,42.24 17,42.33 16.88,42.33 16.79,42.24 16.79,42.02 U1.22 | 17.14,50.32 R2.2 | 16.35,53.34 JP1.1 | 6.83,48.1 R3.1 | 42.75,28.62 42.66,28.53 | 42.75,28.62 42.86,28.73 | U1.3 17.15,42.97 17.14,42.97 | L1.1 31.39,30.44 35.02,34.07 | 35.02,34.07 35.72,34.77 | IC2.21 40.1,31.84 | 42.73,28.87 42.86,28.73 | 35.02,34.07 37.47,31.62 37.47,31.24 37.52,31.19 37.52,30.82 38.23,30.11 38.23,29.97 | IC2.11 36.58,35.44 37.21,36.07 38.86,36.07 v38.89,36.04 | U1.1 18.02,39.41 18.25,39.41 18.67,38.99 | IC2.21 40.1,31.84 38.23,29.97 | 42.75,28.62 39.02,28.62 38.9,28.5 38.31,28.5 37.9,28.92 37.9,29.5 38.23,29.83 38.23,29.97 | v73.03,15.24 71.89,15.24 71.71,15.42 71.08,15.42 70.44,16.06 64.91,16.06 v64.77,16.19
  Top 0.254: IC2.75 44.3,50.28 | IC2.100 32.98,41.8 | IC2.50 52.85,38.99
  Top 0.406: 75.34,10.76 75.13,10.55 R10.2 | 75.34,10.76 76.93,10.76 77.53,10.15 J1.4 81.66,10.16 J1.5 88.22,11.43 | J1.12 92.13,16.61 92.13,15.33 88.22,11.43 | 88.22,11.43 91.53,8.13 93.12,8.13 93.78,7.47 93.78,4.88 J1.9 | 75.34,10.76 75.34,10.83 75.13,11.04 R11.2 R13.2 | v73.03,15.24 74.14,14.13 74.3,14.13 | C24.1 R10.2 | R10.2 74.26,9.62 74.26,6.35 | 17.31,44.91 17.31,48.33 17.17,48.46 17.17,49.07 17.21,49.1 R2.2 | C1.2 32.84,41.8 32.98,41.8 33.64,41.14 37.26,41.14 39.79,43.67 39.79,45.77 44.3,50.28 42.93,51.66 C2.2 | C3.2 53.72,40.39 v53.34,40.01 53.34,39.49 52.85,38.99 | v55.4,37.15 59.45,37.15 60.02,36.57 61.65,36.57 69.02,29.2 69.17,29.2 69.19,29.19
  Top 0.61: IC1.TAB IC1.2 19.81,75.06 18.99,74.23 18.99,69.15 20.07,68.07 R1.1 22.23,67.63 21.12,67.63 19.64,66.15 C10.+ | IC1.TAB 34.26,75.06 36.12,76.91 44.52,76.91 45.72,75.71 45.72,75.69 JP4.5 48.26,75.69 48.26,75.71 49,76.45 56.13,76.45 T1.C 57.4,76.54 57.48,76.55 57.52,76.52 58.33,76.52 58.55,76.35 59.26,75.64 59.26,71.94 58.96,71.64 58.96,54.4 59.48,53.88 63.26,53.88 63.99,54.62 | R6.2 65.32,55.95 63.99,54.62 | 63.99,54.62 63.99,54.58 65.54,53.03 65.54,52.16 65.84,51.86 66.06,51.86 C16.1 73.03,51.12 73.17,51.26 73.97,51.26 U2.3 74.88,51.21 75.6,51.21 75.87,50.94 75.87,46.84 v80.17,42.55 | IC1.TAB 29.9,69.83 28.89,68.83 28.89,68.52 v16.38,56.01 16.26,55.88 6.72,55.88 3.81,52.97 3.81,35.76 v3.74,35.69 | 8.45,35.69 v5.15,35.69 | 8.56,35.69 8.45,35.69 | 8.57,35.68 8.56,35.69 | JP2.1 7.3,53.34 6.83,52.86 6.83,48.16 R3.1 6.67,47.58 5.51,46.43 5.51,44.51 6.09,43.93 7.53,43.93 7.83,43.63 7.83,43.41 C13.1 C12.1 C11.1 8.45,37.73 8.45,35.69 | 8.57,35.8 8.45,35.69 | 8.56,35.69 17.42,35.69 18.75,37.01 18.75,38.91 18.67,38.99 30.24,38.99 30.25,38.98 30.69,39.43 30.69,39.64 C1.2 | 8.45,35.69 10.03,34.11 10.03,19.95 8.89,18.81 CN2.VBUS 13.52,18.36 14.02,18.87 30.41,18.87 v30.48,18.94 | v30.48,17.53 30.48,15.05 | 30.48,15.05 R22.1 | 30.48,15.05 38.12,15.05 39.78,13.38 39.78,13.24 R21.1 43.34,9.68 | R20.1 44.04,10.45 44.04,10.59 48.85,15.4 50.32,15.4 | R15.2 50.36,16.23 52.07,17.94 | R12.1 52.93,17.24 52.93,17.09 53.35,16.67 v54.61,16.67 | JP1.1 17.21,52.39 R2.2
  Bottom 0.254: 80.17,40.96 L2.1 | 75.41,23.34 75.88,23.34 C21.1 | 65.41,15.4 65.41,15.24 66.04,15.24 C19.1
  Bottom 0.61: v16.38,56.01 16.38,53.47 JP1.1 | v3.74,35.69 v5.15,35.69 | v30.48,18.94 v30.48,17.53 | v54.61,16.67 56.52,18.57 56.52,19.56 58.42,21.46 58.8,21.46 59.6,20.66 C17.1 64.04,16.19 v64.77,16.19 65.81,15.15 C19.1 | v73.03,15.24 72.71,15.56 v72.71,20.8 75.26,23.35 | 75.26,23.35 C21.1 | v53.34,40.01 54.73,38.62 54.96,38.62 55.45,38.13 55.45,37.44 55.4,37.4 v55.4,37.15 | v39.05,38.26 38.26,37.47 C5.2 38.89,36.54 v38.89,36.04 | 75.26,23.35 75.93,24.02 75.93,24.96 80.8,29.82 80.8,39.29 80.17,39.92 80.17,40.96 v80.17,42.55
CAN_RX  (via drill 0.35)
  Top 0.254: v45.4,47.31 45.4,47.78 46.04,48.42 IC2.70 | v47.47,52.23 47.94,52.23 48.1,52.39 63.66,52.39 65.88,50.16 74.14,50.16 74.3,50.32 U2.4
  Bottom 0.254: v45.4,47.31 46.2,48.1 46.2,51.28 47.15,52.23 v47.47,52.23
CAN_TX  (via drill 0.35)
  Top 0.254: v44.61,48.1 44.93,48.1 45.72,48.9 IC2.71 | v64.14,53.18 v47.47,53.18 | v65.72,54.13 74.3,54.13 U2.1
  Bottom 0.254: v44.61,48.1 45.72,49.21 45.72,51.44 v47.47,53.18 | v64.14,53.18 64.77,53.18 v65.72,54.13
ETH_MII_COL  (via drill 0.35)
  Top 0.254: v44.29,29.53 44.29,30.48 IC2.26 | v58.58,34.45 51.28,34.45 46.7,29.88 v46.7,28.35 | v58.74,38.89 63.18,38.89 72.07,30 72.07,27.78 70.96,26.67 IC3.42
  Bottom 0.254: v58.58,34.45 58.74,34.61 v58.74,38.89 | v44.29,29.53 45.53,29.53 v46.7,28.35
ETH_MII_CRS_WKUP  (via drill 0.35)
  Top 0.254: IC3.40 71.64,25.98 71.67,26.02 71.76,26.06 71.79,26.13 72.95,27.3 72.95,30.33 63.19,40.09 63.03,40.09 62.74,40.39 62.71,40.39 v62.67,40.34 | v45.21,25.15 v42.93,22.86 | v38.61,29.21 38.82,29.21 IC2.23
  Bottom 0.254: v62.67,40.34 60.98,38.66 60.98,35.92 50.12,25.06 48.78,25.06 48.7,25.15 v45.21,25.15 | v38.61,29.21 39.28,28.54 39.28,27.45 42.93,23.81 v42.93,22.86
ETH_MII_MDC  (via drill 0.35)
  Top 0.254: v37.66,32.51 37.62,32.54 37.62,33.02 38.26,33.66 IC2.16 | IC3.31 70.96,21.11 72.07,20 72.87,20 75.03,21.91 75.03,32.77 73.98,33.81 70.87,33.81 62.8,41.71 62.41,42.09 62.41,42.44 62.03,42.82 61.48,42.82 61.1,42.44 61.1,42.2 58.1,39.21 55.09,39.21 43.95,28.08 43.95,27.87 43.79,27.71 42.06,27.71 41.65,28.12 40.53,28.12 40.34,27.94 37.85,27.94 36.39,29.4 v36.39,31.43
  Bottom 0.254: v36.39,31.43 v37.66,32.51
ETH_MII_MDIO  (via drill 0.35)
  Top 0.254: v75.88,17.3 73.98,17.3 70.64,20.64 IC3.30 | v66.2,10.48 61.12,10.48 55.88,15.72 55.88,19.53 49.69,25.72 v49.05,25.72 | v41.59,29.53 41.59,30.48 IC2.25
  Bottom 0.254: v75.88,17.3 75.88,8.1 75.25,7.46 67.94,7.46 66.2,9.21 v66.2,10.48 | v49.05,25.72 48.9,25.88 45.24,25.88 v41.59,29.53
ETH_MII_RX_CLK  (via drill 0.35)
  Top 0.254: v42.55,30.32 42.55,30.96 42.07,31.43 41.75,31.43 41.27,30.96 IC2.24 | v48.74,26.67 62.87,26.67 v63.66,27.46 | IC3.38 72.39,25.24 74.01,26.86 74.01,31.37 v73.09,32.29
  Bottom 0.254: v42.55,30.32 46.2,26.67 v48.74,26.67 | v63.66,27.46 64.45,27.46 66.83,25.08 67.15,25.08 73.09,31.02 v73.09,32.29
ETH_MII_RX_DV  (via drill 0.35)
  Top 0.254: v61.75,42.16 73.53,30.64 73.53,27.18 72.07,25.72 IC3.39 | 51.44,43.18 IC2.55 51.41,43.28 51.99,43.86 52.88,44.75 58.05,44.75 58.62,44.17 59.17,44.17 59.5,44.51 60.9,44.51 v61.75,43.66
  Bottom 0.254: v61.75,43.66 v61.75,42.16
ETH_MII_RX_ER  (via drill 0.35)
  Top 0.254: v50.01,41.43 49.69,41.12 49.69,39.85 50.32,39.21 50.48,39.21 51.75,37.94 IC2.47 | v59.53,39.69 63.02,39.69 72.55,30.16 72.55,27.46 71.44,26.35 IC3.41
  Bottom 0.254: v50.01,41.43 52.55,43.97 55.24,43.97 v59.53,39.69
ETH_MII_RXD0  (via drill 0.35)
  Top 0.254: v54.61,37.78 54.93,38.1 63.34,38.1 71.6,29.84 71.6,27.94 70.64,26.99 IC3.43 | v50.96,41.43 50.96,42.07 50.32,42.7 50.32,42.86 50.96,43.5 IC2.56
  Bottom 0.254: v50.96,41.43 v54.61,37.78
ETH_MII_RXD1  (via drill 0.35)
  Top 0.254: v60.33,37.31 63.5,37.31 71.12,29.69 71.12,28.26 70.33,27.46 IC3.44 | IC2.57 50.8,43.97 51.66,44.83 51.69,44.83 52.01,45.16 58.6,45.16 58.9,44.86 v58.9,44.83
  Bottom 0.254: v60.33,37.31 60.33,40.16 58.9,41.59 v58.9,44.83
ETH_MII_RXD2  (via drill 0.35)
  Top 0.254: v66.52,39.05 66.2,39.05 64.61,40.64 64.61,41.75 60.8,45.56 51.59,45.56 50.32,44.29 IC2.58 | v66.52,33.34 70.64,29.21 70.64,28.42 70.01,27.78 IC3.45
  Bottom 0.254: v66.52,33.34 v66.52,39.05
ETH_MII_RXD3  (via drill 0.35)
  Top 0.254: v65.41,40.8 65.41,41.59 60.96,46.04 51.44,46.04 50.01,44.61 IC2.59 | v65.41,34.45 65.41,33.5 69.22,29.69 69.37,29.69 70.17,28.89 70.17,28.73 69.53,28.1 IC3.46
  Bottom 0.254: v65.41,34.45 v65.41,40.8
ETH_MII_TX_CLK  (via drill 0.35)
  Top 0.254: v43.5,30.32 43.34,30.48 43.34,31.43 41.12,33.66 39.69,33.66 39.05,33.02 IC2.18 | v53.18,36.35 59.21,36.35 66.67,28.89 IC3.1
  Bottom 0.254: v43.5,30.32 45.72,30.32 48.58,27.46 48.9,27.46 53.18,31.75 v53.18,36.35
ETH_MII_TX_EN  (via drill 0.35)
  Top 0.254: v52.07,35.24 59.69,35.24 66.52,28.42 IC3.2 | v51.44,40.01 51.44,39.69 51.28,39.53 51.28,39.05 52.07,38.26 IC2.48
  Bottom 0.254: v52.07,35.24 51.44,35.88 v51.44,40.01
ETH_MII_TXD0  (via drill 0.35)
  Top 0.254: v57.78,33.66 60.48,33.66 66.04,28.1 IC3.3 | 52.86,41.75 IC2.51 | IC2.51 52.98,41.8 | IC2.51 52.83,41.87 53.41,42.45 53.41,42.68 52.83,43.26 52.83,44.12 53.05,44.34 57.78,44.34 v57.78,40.01
  Bottom 0.254: v57.78,33.66 v57.78,40.01
ETH_MII_TXD1  (via drill 0.35)
  Top 0.254: v50.48,32.7 60.8,32.7 65.72,27.78 IC3.4 | v50.48,40.01 51.75,41.27 51.75,41.43 52.39,42.07 IC2.52
  Bottom 0.254: v50.48,40.01 v50.48,32.7
ETH_MII_TXD2  (via drill 0.35)
  Top 0.254: v40.48,34.45 39.85,34.45 38.73,33.34 IC2.17 | v48.74,28.26 64.45,28.26 65.41,27.3 IC3.5
  Bottom 0.254: v40.48,34.45 42.55,34.45 v48.74,28.26
ETH_MII_TXD3  (via drill 0.35)
  Top 0.254: v37.94,42.86 35.56,42.86 34.92,43.5 IC2.95 | v64.29,24.29 64.29,24.61 65.72,26.04 65.72,26.35 65.09,26.99 IC3.6
  Bottom 0.254: v37.94,42.86 40.16,40.64 40.16,35.08 39.69,34.61 39.69,27.62 43.02,24.29 v64.29,24.29
ETH_X1  (via drill 0.35)
  Top 0.254: 82.55,36.2 84.3,34.45 84.93,34.45 Q1.1 | v73.82,33.02 74.55,32.29 74.55,23.27 72.87,21.59 72.55,21.59 72.07,22.07 IC3.34 | v73.82,34.61 80.96,34.61 82.55,36.2 | 82.55,36.2 C18.1
  Bottom 0.254: v73.82,34.61 v73.82,33.02
ETH_X2  (via drill 0.35)
  Top 0.254: Q1.3 86.68,32.07 84.93,30.32 82.55,30.32 C20.1 82.55,30.16 80.8,28.42 v76.36,28.42 | v71.12,23.18 70.96,23.02 70.96,22.54 71.6,21.91 IC3.33
  Bottom 0.254: v76.36,28.42 v71.12,23.18
FOTO_TRAN  (via drill 0.35)
  Top 0.254: v46.99,45.72 44.77,43.5 44.77,32.23 45.4,31.59 IC2.29 | v46.99,51.12 46.99,51.75 46.67,52.07 46.67,63.34 56.2,72.87 R16.2 56.36,73.03 57.31,73.98 57.31,75.88 T1.E
  Bottom 0.254: v46.99,51.12 v46.99,45.72
GND  (via drill 0.35)
  Top 0.254: 32.7,42.86 33.34,42.23 IC2.99 | 32.7,42.86 32.7,43.02 34.29,44.61 34.45,44.61 35.08,43.97 IC2.94 | 62.71,20.8 62.71,21.27 63.5,22.07 IC3.15 | 62.71,20.8 62.71,20.32 63.34,19.68 63.98,19.68 64.93,20.64 IC3.19 | 14.68,42.47 14.76,42.55 14.92,42.55 U1.17 | 14.68,42.47 14.61,42.39 14.61,42.23 14.76,42.07 14.92,42.07 U1.18 14.92,41.91 14.92,41.75 15.24,41.43 15.32,41.51 | 14.68,42.94 14.61,42.86 14.61,42.55 14.68,42.47 | 14.68,42.94 14.76,43.02 14.92,43.02 U1.16 | 14.61,43.34 14.92,43.34 U1.15 | 14.61,43.34 14.61,43.02 14.68,42.94 | 14.61,43.34 14.61,43.66 14.76,43.81 14.92,43.81 U1.14 | 15.32,41.51 15.4,41.59 15.4,41.91 U1.19 | U1.20 15.88,41.91 15.88,41.59 15.72,41.43 15.4,41.43 15.32,41.51 | IC2.74 44.77,50.01 45.4,50.64 45.4,51.28 43.02,53.66 C2.1 | 72.55,23.02 72.23,23.02 71.28,23.97 70.96,23.97 70.8,23.81 70.01,23.81 68.58,25.24 68.58,27.78 69.06,28.26 IC3.47 | IC2.49 52.39,38.73 51.75,39.37 53.82,41.43 55.56,41.43 56.52,40.48 C3.1 | v62.55,20.8 62.71,20.8 | 32.7,42.86 32.07,42.86 29.69,40.48 C1.1 | 72.55,23.02 IC3.36 | 72.55,23.02 72.69,22.88 | IC2.19 39.39,32.28 v38.23,31.11
  Bottom 0.254: v38.23,31.11 38.23,30.86 37.85,30.48
  other vias: 80.77,25.91 73.41,24.13 71.37,11.43 58.67,5.84 53.59,7.62 32.26,11.94 25.91,14.99 17.27,6.86 13.72,3.56 12.19,13.72 21.08,27.69 25.15,40.89 6.86,33.02 56.26,69.34 61.72,73.28 71.25,55.88 26.16,57.53 22.1,50.16 32.51,66.55 21.72,64.14 37.21,10.67 38.35,40.26 56.9,43.56 68.58,14.22 21.08,72.14 15.49,68.2 13.08,37.85 12.83,43.69 5.33,41.4 36.83,19.68 6.48,77.34
  pour Top: -0.51,80.77 101.09,80.77 101.09,-1.78 -0.51,-1.78
  pour Bottom: -1.02,81.03 101.35,81.03 101.35,-1.02 -1.02,-1.02
GPIO_IN1  (via drill 0.35)
  Top 0.254: S2.3 43.02,2.54 50.96,2.54 S2.4 51.12,2.54 C26.1 | v47.78,49.69 47.47,49.69 46.2,50.96 46.2,52.39 43.66,54.93 41.43,54.93 39.05,52.55 39.05,49.21 39.69,48.58 IC2.81 | v48.42,29.53 48.42,28.89 47.94,28.42 47.94,25.88 53.66,20.16 54.61,20.16 55.4,19.37 55.4,4.29 C26.1 | C26.1
  Bottom 0.254: v47.78,49.69 47.62,49.53 47.62,46.04 47.78,45.88 47.78,30.8 47.62,30.64 47.62,30.32 v48.42,29.53
GPIO_IN2  (via drill 0.35)
  Top 0.254: S3.3 32.86,2.54 40.8,2.54 S3.4 40.96,2.7 41.91,3.65 41.91,7.94 40.64,9.21 40.64,9.53 C27.1 40.64,9.72 v40.64,11.05 | IC2.82 39.39,48.23 38.81,48.81 38.65,48.97 38.65,51.32 v37.01,52.96
  Bottom 0.254: v37.01,52.96 36.62,52.57 36.08,52.57 35.54,52.02 35.54,41.99 34.11,40.56 34.11,17.58 v40.64,11.05
GPIO_IN3
  Top 0.254: C28.1 28.57,9.53 30,8.1 31.59,8.1 31.75,7.94 31.75,3.65 30.8,2.7 S4.4 30.64,2.54 22.7,2.54 S4.3 22.54,2.7 22.54,3.65 15.4,10.79 12.06,10.79 11.91,10.64 7.3,10.64 4.13,13.81 4.13,19.68 4.45,20 4.45,52.7 6.99,55.24 31.43,55.24 38.1,48.58 38.26,48.58 38.89,47.94 IC2.83
GPIO_OUT1  (via drill 0.35)
  Top 0.254: v41.59,54.13 41.59,51.28 42.55,50.32 42.55,49.85 39.53,46.83 39.37,46.83 38.73,47.47 IC2.84 | v41.59,55.72 41.59,59.21 37.15,63.66 R26.2
  Bottom 0.254: v41.59,55.72 v41.59,54.13
GPIO_OUT2  (via drill 0.35)
  Top 0.254: v39.05,45.88 39.05,46.35 38.42,46.99 IC2.85 | R27.2 35.56,61.28 35.56,51.75 35.58,51.75 36.08,51.25 36.63,51.25 v37.24,50.64
  Bottom 0.254: 38.26,46.67 v39.05,45.88 37.24,47.69 v37.24,50.64
GPIO_OUT3  (via drill 0.35)
  Top 0.254: v34.29,51.44 34.61,51.44 37.15,48.9 37.15,47.62 37.94,46.83 IC2.86 | v34.29,53.34 34.29,58.9 R28.2
  Bottom 0.254: v34.29,53.34 v34.29,51.44
IMU_I2C_SCL  (via drill 0.35)
  Top 0.254: 19.91,42.55 31.11,42.55 33.27,44.7 33.27,44.96 32.51,45.72 33.74,46.94 35.24,45.44 35.24,45.24 35.72,44.77 IC2.92 | 19.91,42.55 18.1,42.55 U1.2 | v16.35,48.04 13.65,47.94 8.57,47.94 R3.2 | 19.91,42.55 v19.91,48.04
  Bottom 0.254: v19.91,48.04 v16.35,48.04
IMU_I2C_SDA  (via drill 0.35)
  Top 0.254: R2.1 14.22,50.29 v13.72,50.8 | U1.4 18.08,43.41 18.23,43.4 18.25,43.41 18.95,43.41 v19.05,43.31 | v33.78,45.72 34.06,45.72 IC2.93 | v20.83,43.31 29.34,43.31 v29.46,43.43
  Bottom 0.254: v13.72,50.8 14.93,49.58 14.93,48.5 16.05,47.38 16.62,47.38 16.74,47.5 19.05,47.5 19.3,47.24 19.3,43.56 v19.05,43.31 v20.83,43.31 | v29.46,43.43 29.8,43.43 30.46,44.09 32.15,44.09 v33.78,45.72
LED_LNK
  Top 0.254: IC3.28 70.01,20 70.64,19.37 70.64,17.14 71.28,16.51 80.17,16.51 89.22,25.56 R18.2
LED_SPD  (via drill 0.35)
  Top 0.254: v69.37,22.38 68.9,21.91 68.9,20.32 69.37,19.84 IC3.27 | v77.15,27.62 89.06,27.62 90.17,26.51 90.17,24.77 90.33,24.61 92.71,24.61 93.66,25.56 R19.2
  Bottom 0.254: v69.37,22.38 69.37,24.77 73.82,29.21 76.52,29.21 77.15,28.57 v77.15,27.62
N$1
  Top 0.254: 76.04,14.29 74.3,16.03 71.12,16.03 67.79,19.37 67.79,21.27 65.56,23.5 63.5,23.5 63.02,23.02 IC3.13 | 76.04,14.29 R13.1 | J1.6 77.63,12.7 76.04,14.29
N$2
  Top 0.254: R8.2 82.23,48.1 84.3,48.1 86.52,50.32 X1.5
N$3
  Top 0.254: R5.1 78.42,57.78 78.42,53.18 79.85,51.75 80.49,51.75 U2.6 80.64,51.75 81.12,51.75 81.92,52.55 81.92,52.7 86.52,57.31 86.52,58.58 X1.2
N$4
  Top 0.254: R4.2 73.03,57.94 76.36,61.28 JP3.2 76.52,61.12 77.47,60.17 79.85,60.17 81.28,58.74 81.28,56.99 80.64,56.36 80.64,54.29 U2.8
N$5
  Top 0.254: U2.7 80.49,53.02 79.85,53.02 79.22,53.66 79.22,54.77 80.17,55.72 80.17,57.78 R5.2 80.17,57.94 79.06,59.05 77.47,59.05 77.31,58.9 77.31,51.75 79.38,49.69 81.6,49.69 86.2,54.29 86.52,54.29 89.06,56.83 89.06,57.15 X1.7
N$6
  Top 0.254: JP3.3 70.64,57.94 66.83,57.94 R6.1
N$7  (via drill 0.35)
  Top 0.254: v66.99,11.27 60.96,11.27 60.33,11.91 60.33,21.43 60.96,22.07 61.28,22.07 61.44,21.91 62.71,21.91 63.18,22.38 IC3.14 | v66.99,9.37 67.63,9.37 72.39,4.6 83.66,4.6 83.66,5.26 83.92,5.52 83.92,7.18 82.93,8.17 J1.3 82.93,9.78 v82.62,10.09 | v81.41,11.3 76.77,11.3 R11.1
  Bottom 0.254: v66.99,9.37 v66.99,11.27 | v82.62,10.09 v81.41,11.3
N$8  (via drill 0.35)
  Top 0.254: v63.5,20.48 63.34,20.64 63.34,21.11 63.98,21.75 IC3.16 | v75.09,8.26 75.09,8.57 76.04,9.53 R10.1 78.36,9.65 J1.2
  Bottom 0.254: v63.5,20.48 75.09,8.89 v75.09,8.26
N$9
  Top 0.254: IC3.24 66.67,18.89 66.04,18.26 65.88,18.26 63.98,16.35 63.98,15.21 R7.1
N$10  (via drill 0.35)
  Top 0.254: v65.56,22.54 65.41,22.54 64.45,21.59 IC3.17 | v71.28,13.65 71.28,12.86 68.9,10.48 68.9,8.73 72.39,5.24 74.93,5.24 76.04,6.35 R9.1 J1.1
  Bottom 0.254: v65.56,22.54 69.37,18.73 69.37,15.24 70.96,13.65 v71.28,13.65
N$11  (via drill 0.35)
  Top 0.254: v41.12,32.7 41.12,32.23 40.48,31.59 IC2.22 | v40.8,27.46 39.3,25.96 C7.+ 35.51,26.21 L1.2 33.38,28.19 C6.2
  Bottom 0.254: v41.12,32.7 40.8,32.38 v40.8,27.46
N$12
  Top 0.254: R1.2 24.57,70.13 LED1.A
N$13
  Top 0.254: R18.1 91.12,25.72 91.92,25.72 93.03,26.83 96.36,26.83 96.68,26.51 96.68,4.92 94.46,2.7 93.66,2.7 92.55,3.81 92.55,6.35 J1.10
N$14
  Top 0.254: R19.1 95.69,24.95 93.34,22.61 93.34,18.41 94.11,17.65 94.11,14.68 J1.11
N$15
  Top 0.254: C15.1 U1.24
N$16
  Top 0.254: C14.1 8.57,44.54 9.55,43.56 9.55,42.55 12.22,39.88 16.26,39.88 16.3,39.92 U1.21
N$17
  Top 0.254: R14.1 66.36,74.36 D1.A
N$18
  Top 0.254: LED2.A 74.68,71.82 R17.1
N$19  (via drill 0.35)
  Top 0.254: C25.1 87.12,21.97 84.84,19.68 | 84.84,19.68 J1.8 83.44,15.24 85.85,12.83 v85.85,12.19 | 84.84,19.68 85.22,19.68 J1.S1 | v85.85,10.41 85.85,3.3 J1.S2
  Bottom 0.254: v85.85,12.19 v85.85,10.41
N$20
  Top 0.254: S2.1 43.02,7.14 43.02,7.46 45.09,9.53 R20.2 45.24,9.68 48.74,9.68 R23.2 48.9,9.53 50.96,7.46 50.96,7.14 S2.2
N$21
  Top 0.254: S3.1 32.86,7.14 34.92,9.21 34.92,9.53 R24.2 35.08,9.68 35.96,10.56 | 35.96,10.56 37.78,12.38 38.58,12.38 R21.2 | 35.96,10.56 39.37,7.14 40.8,7.14 S3.2
N$22
  Top 0.254: R25.2 23.18,12.38 23.18,9.68 R22.2 23.18,9.53 22.7,9.05 22.7,7.14 | 22.7,7.14 30.64,7.14 S4.2 | 22.7,7.14 S4.1
N$23
  Top 0.254: LED3.A 32.7,63.82 35.08,63.82 R26.1
N$24  (via drill 0.35)
  Top 0.254: 64.06,17.7 61.75,15.4 61.75,13.02 C22.+ | 64.06,17.7 66.04,19.68 IC3.22 | v63.82,17.78 63.98,17.78 64.06,17.7
  Bottom 0.254: L2.2 77.47,40.8 77.47,38.73 77.79,38.42 C23.1 77.63,38.42 77.63,35.88 73.98,32.23 73.98,31.91 74.3,31.59 74.3,31.27 66.36,23.34 64.14,23.34 61.75,20.95 61.75,19.84 v63.82,17.78
N$25
  Top 0.254: LED4.A 31.11,61.59 33.5,61.59 33.66,61.44 R27.1
N$27
  Top 0.254: LED5.A 30.16,59.05 32.38,59.05 R28.1
NRST  (via drill 0.35)
  Top 0.254: 11.67,9.45 9.84,7.62 S1.3 9.68,7.62 1.91,7.62 S1.4 | 11.67,9.45 11.75,9.53 12.7,9.53 C9.1 12.86,9.53 20.95,1.43 58.1,1.43 v71.44,14.76 | v71.44,17.3 71.44,19.21 70.33,20.32 IC3.29 | 11.67,9.45 v11.27,9.84 | CN2.D+ 8.89,16.67 10,16.67 10.1,16.76 13.46,16.76 | v14.83,11.56 14.83,15.4 13.46,16.76 | IC2.14 37.56,34.38 36.98,33.8 36.84,33.8 v36.58,33.53 | v17.27,17.53 14.22,17.53 13.46,16.76 | v23.62,20.57 v35.56,32.51
  Bottom 0.254: v71.44,14.76 v71.44,17.3 | v11.27,9.84 13.24,9.84 14.83,11.43 v14.83,11.56 | 17.02,17.27 v17.27,17.53 20.57,17.53 v23.62,20.57 | v35.56,32.51 v36.58,33.53
PFB  (via drill 0.35)
  Top 0.254: IC3.18 64.77,21.27 65.25,21.75 65.56,21.75 67.15,20.16 67.15,20 66.52,19.37 IC3.23 66.36,19.21 65.88,18.73 65.72,18.73 63.5,16.51 63.5,13.65 64.61,12.54 67.94,12.54 70.17,14.76 v70.17,15.4 | v70.17,24.61 71.28,24.61 71.6,24.29 72.07,24.29 72.55,24.77 IC3.37
  Bottom 0.254: v70.17,15.4 v70.17,24.61
PWM_IR  (via drill 0.35)
  Top 0.254: v59.85,50.8 51.91,50.8 47.94,46.83 IC2.65 | v59.85,54.77 59.85,68.26 62.71,71.12 R14.2
  Bottom 0.254: v59.85,54.77 v59.85,50.8
PWM_LED  (via drill 0.35)
  Top 0.254: v43.66,47.62 44.77,46.51 46.99,46.51 47.47,46.99 IC2.66 | v48.26,51.59 63.34,51.59 65.56,49.37 72.39,49.37 80.01,41.75 80.64,41.75 90.33,51.44 90.33,57.63 89.06,58.9 87.95,58.9 86.52,60.33 86.04,60.33 76.33,70.04 74.61,70.04 73.53,71.12 R17.2
  Bottom 0.254: v43.66,47.62 43.66,50.32 47.31,53.98 47.62,53.98 48.26,53.34 v48.26,51.59
RSVD20  (via drill 0.35)
  Top 0.254: v54.45,19.37 54.13,19.05 54.13,18.1 R12.2 | v61.12,21.27 63.18,19.21 64.29,19.21 65.41,20.32 IC3.20
  Bottom 0.254: v54.45,19.37 55.24,19.37 58.42,22.54 59.85,22.54 v61.12,21.27
RSVD21  (via drill 0.35)
  Top 0.254: v54.61,15.56 52.39,15.56 R15.1 | v61.12,16.03 63.82,18.73 64.45,18.73 65.72,20 IC3.21
  Bottom 0.254: v54.61,15.56 60.64,15.56 v61.12,16.03
SDO_A/G
  Top 0.254: U1.5 18.1,43.81 18.26,43.81 18.73,44.29 18.73,53.34 JP1.2
SDO_M  (via drill 0.35)
  Top 0.254: JP2.2 10,53.34 | 10.21,53.34 JP2.2 | U1.6 18.02,48.77 v17.91,48.77 | v15.62,48.77 14.61,48.77 10.03,53.34 JP2.2
  Bottom 0.254: v17.91,48.77 v15.62,48.77
SPI_CLK  (via drill 0.35)
  Top 0.254: v36.2,48.9 36.2,46.35 36.83,45.72 IC2.89 | v36.35,51.91 36.35,60.33 36.51,60.48 36.51,62.39 36.04,62.87 36.04,71.6 JP4.2
  Bottom 0.254: v36.2,48.9 36.35,49.05 v36.35,51.91
SPI_MISO  (via drill 0.35)
  Top 0.254: v31.27,54.45 31.27,50.64 36.51,45.4 IC2.90 | v31.27,56.04 31.27,56.36 29.21,58.42 29.21,60.33 29.84,60.96 29.84,62.87 29.53,63.18 29.53,68.57 35.74,74.78 35.74,75.64 36.38,76.28 42.6,76.28 JP4.4
  Bottom 0.254: v31.27,56.04 v31.27,54.45
SPI_SELECT  (via drill 0.35)
  Top 0.254: IC2.91 36.21,45.05 30.87,50.39 30.87,52.95 30.48,53.34 v30.48,53.59 | JP4.6 49.53,74.17 v38.86,63.5
  Bottom 0.254: v38.86,63.5 32.06,56.7 31,56.7 30.48,56.17 v30.48,53.59
SWCLK  (via drill 0.35)
  Top 0.254: v39.85,50.48 40.32,50.96 40.8,50.96 41.43,50.32 IC2.76 | v34.77,34.77 25.56,34.77 v11.78,20.99 | CN2.ID 8.89,15.88 10,15.88 10.19,16.07 v11.78,16.07
  Bottom 0.254: v39.85,50.48 39.85,45.72 34.77,40.64 v34.77,34.77 | v11.78,16.07 v11.78,20.99
SWDIO  (via drill 0.35)
  Top 0.254: v48.42,48.26 48.26,48.26 46.67,49.85 46.04,49.85 IC2.72 | v48.42,30.48 47.5,29.56 47.5,26.42 45.5,24.41 45.48,24.41 43.22,22.15 43.18,22.15 | 43.18,22.15 | CN2.D- 13.62,17.56 14.29,18.23 39.27,18.23 43.18,22.15
  Bottom 0.254: v48.42,30.48 v48.42,48.26
VCC
  Top 0.254: C8.+ 17.78,73.82
  Top 0.813: IC1.3 25,71.44 25.52,71.44 25.88,71.08 25.88,67.12 25.48,66.71 21.5,66.71 19.03,64.24 11.29,64.24 CN1.PWR1 10.77,66.25 C8.+